# Altium schematic sheet 09_Clocks_2.SchDoc: Clocks 2
size A3; Organization: Lime Microsystems; Address1: Surrey Tech Centre; Address2: Guildford GU2 7YG; Address3: Surrey; Address4: United Kingdom; Revision: v1.0; SheetNumber: 7; SheetTotal: 10
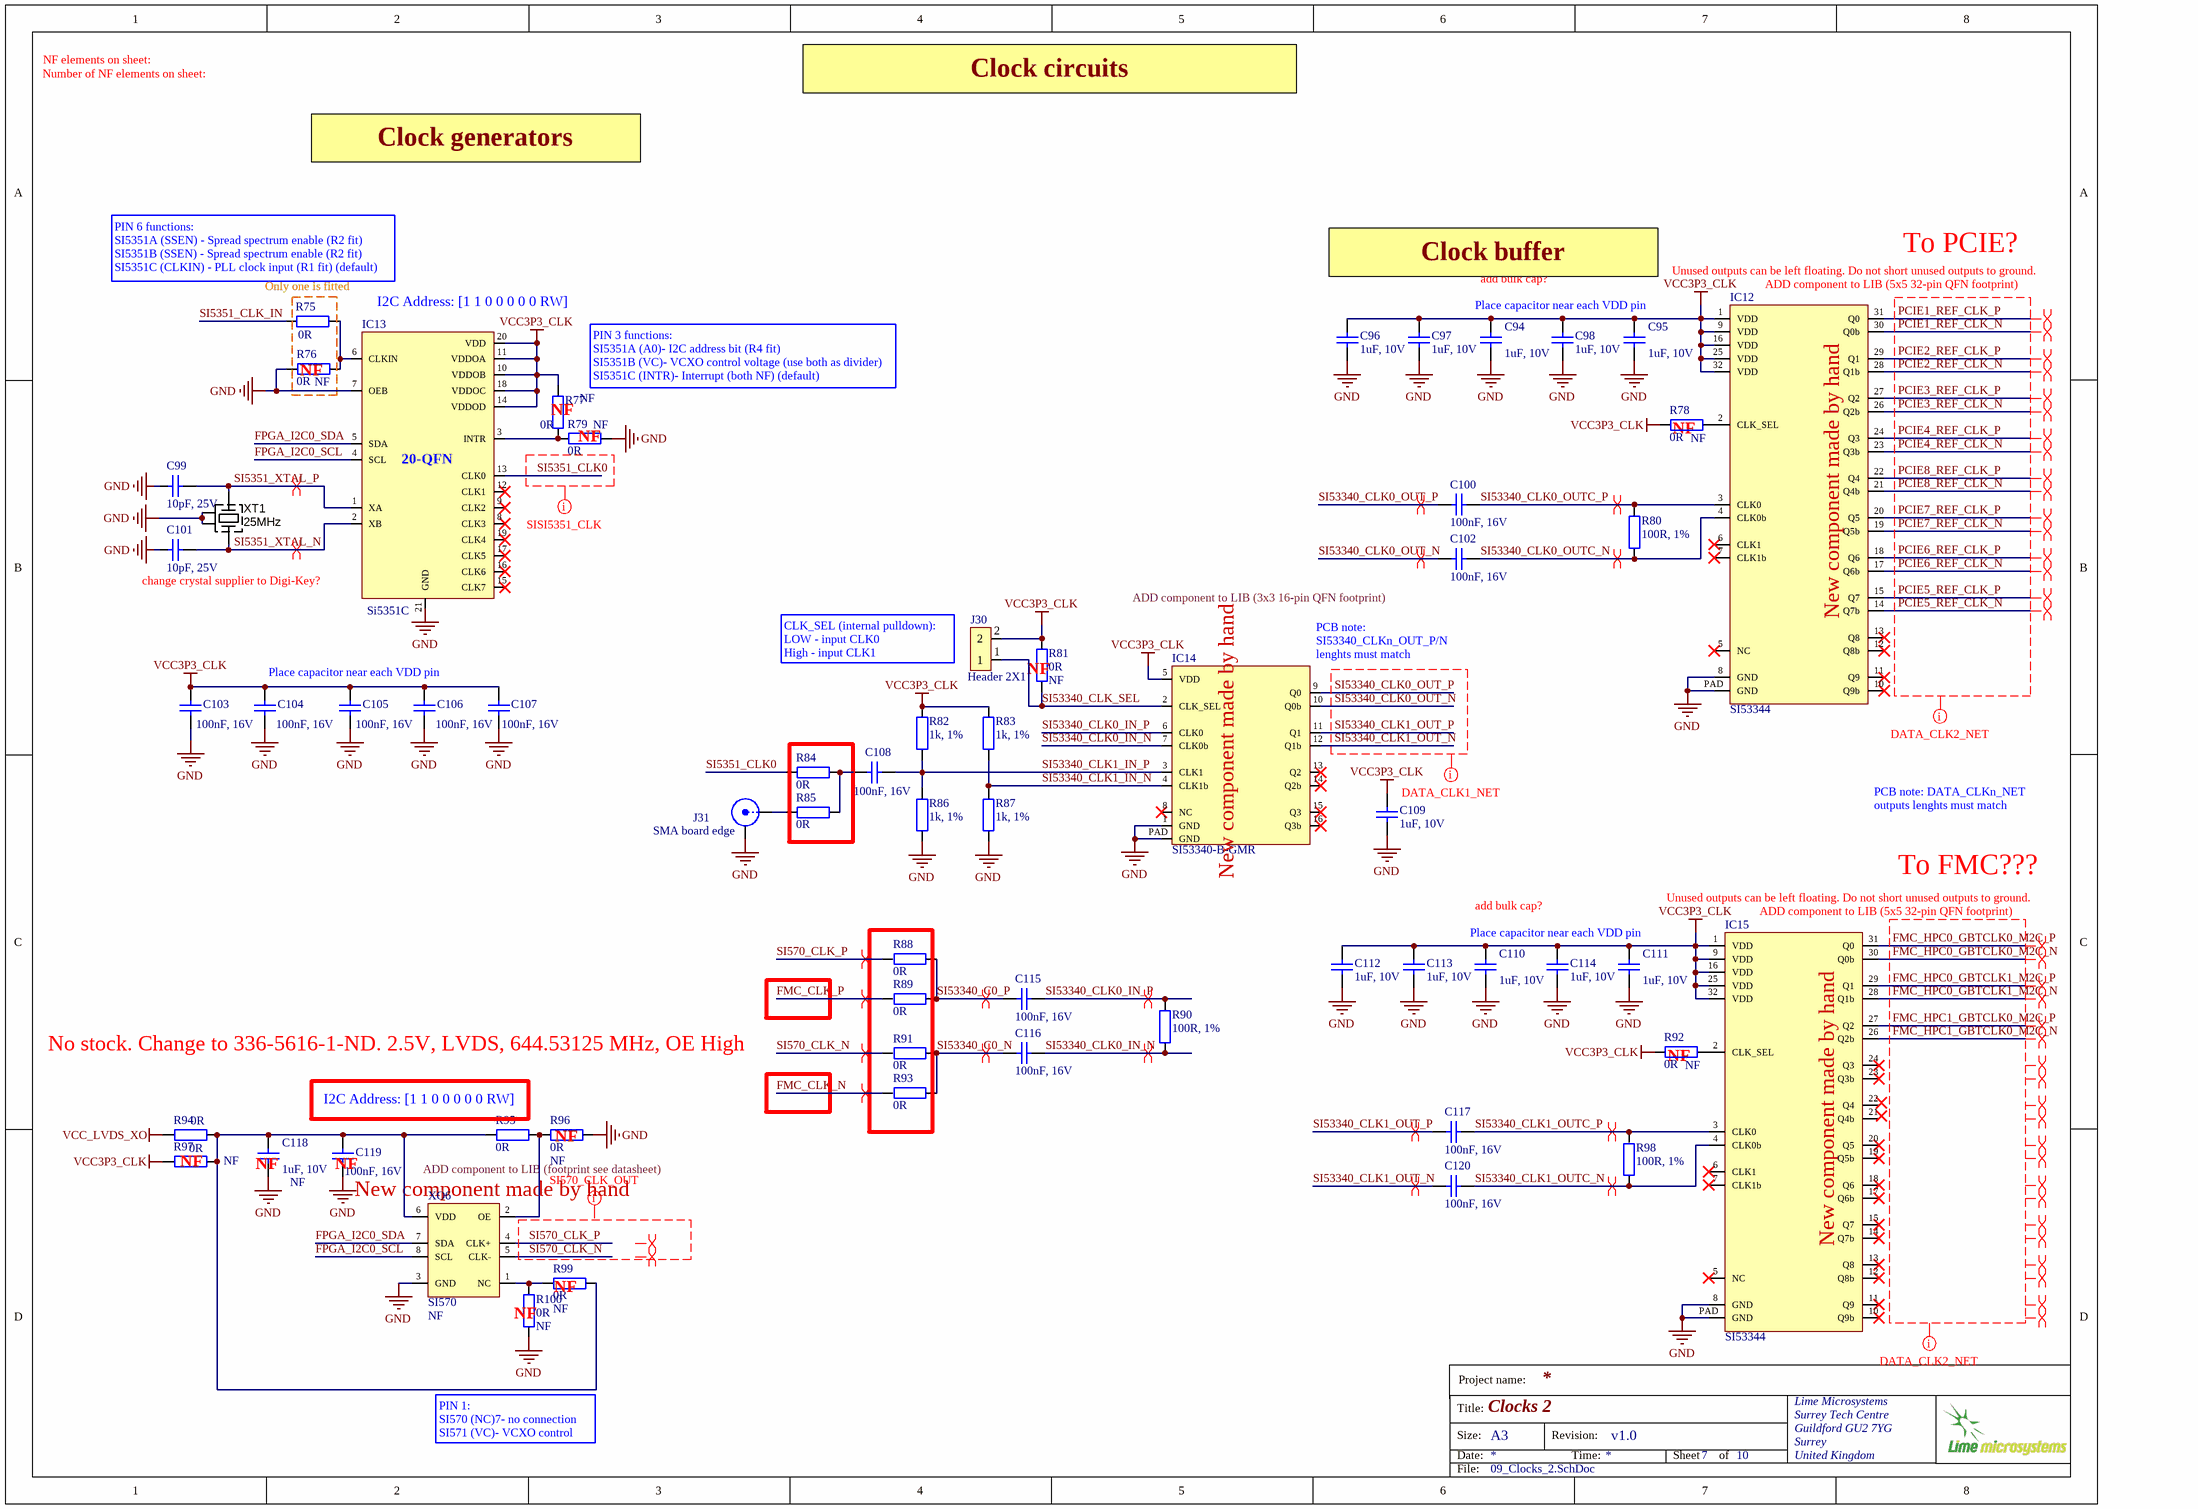
[diagram p0: 09_Clocks_2.SchDoc]

## Parts
C94  1uF, 10V  [CAP0402]
C95  1uF, 10V  [CAP0402]
C96  1uF, 10V  [CAP0402]
C97  1uF, 10V  [CAP0402]
C98  1uF, 10V  [CAP0402]
C99  10pF, 25V  [CAP0402]
C100  100nF, 16V  [CAP0402]
C101  10pF, 25V  [CAP0402]
C102  100nF, 16V  [CAP0402]
C103  100nF, 16V  [CAP0402]
C104  100nF, 16V  [CAP0402]
C105  100nF, 16V  [CAP0402]
C106  100nF, 16V  [CAP0402]
C107  100nF, 16V  [CAP0402]
C108  100nF, 16V  [CAP0402]
C109  1uF, 10V  [CAP0402]
C110  1uF, 10V  [CAP0402]
C111  1uF, 10V  [CAP0402]
C112  1uF, 10V  [CAP0402]
C113  1uF, 10V  [CAP0402]
C114  1uF, 10V  [CAP0402]
C115  100nF, 16V  [CAP0402]
C116  100nF, 16V  [CAP0402]
C117  100nF, 16V  [CAP0402]
C118  1uF, 10V  Assembly Info: NF  [CAP0402]
C119  100nF, 16V  [CAP0402]
C120  100nF, 16V  [CAP0402]
IC12  SI53344  [SI53344-B-GM_32-VFQFN]
IC13  Si5351C  [Si5351C_20QFN]
IC14  SI53340-B-GMR  [SI53340_QFN24]
IC15  SI53344  [SI53344-B-GM_32-VFQFN]
J30  Header 2X1  [HDR_1x2]
J31  SMA board edge  [SMA_connector_board_edge_SM]
R75  0R  [RES0402]
R76  0R  Assembly Info: NF  [RES0402]
R77  0R  Assembly Info: NF  [RES0402]
R78  0R  Assembly Info: NF  [RES0402]
R79  0R  Assembly Info: NF  [RES0402]
R80  100R, 1%  [RES0402]
R81  0R  Assembly Info: NF  [RES0402]
R82  1k, 1%  [RES0402]
R83  1k, 1%  [RES0402]
R84  0R  [RES0402]
R85  0R  [RES0402]
R86  1k, 1%  [RES0402]
R87  1k, 1%  [RES0402]
R88  0R  [RES0402]
R89  0R  [RES0402]
R90  100R, 1%  [RES0402]
R91  0R  [RES0402]
R92  0R  Assembly Info: NF  [RES0402]
R93  0R  [RES0402]
R94  0R  [RES0402]
R95  0R  [RES0402]
R96  0R  Assembly Info: NF  [RES0402]
R97  0R  Assembly Info: NF  [RES0402]
R98  100R, 1%  [RES0402]
R99  0R  Assembly Info: NF  [RES0402]
R100  0R  Assembly Info: NF  [RES0402]
XO6  SI570  Assembly Info: NF  [Si570_Si571_CRYSTAL_8SMD]
XT1  25MHz  [CRYSTAL_4-LCC]

## Nets
GND: C94.1 C95.1 C96.2 C97.2 C98.2 C99.1 C101.1 C103.2 C104.2 C105.2 C106.2 C107.2 C109.2 C110.1 C111.1 C112.2 C113.2 C114.2 C118.1 C119.2 IC12.8(GND) IC12.PAD(GND) IC13.7(OEB) IC13.21(GND) IC14.1(GND) IC14.PAD(GND) IC15.8(GND) IC15.PAD(GND) J31.2(Y) R76.2 R79.2 R86.1 R87.1 R96.1 R100.1 XO6.3(GND) XT1.2(GND) XT1.4(GND)
VCC3P3_CLK: C94.2 C95.2 C96.1 C97.1 C98.1 C103.1 C104.1 C105.1 C106.1 C107.1 C109.1 C110.2 C111.2 C112.1 C113.1 C114.1 IC12.1(VDD) IC12.9(VDD) IC12.16(VDD) IC12.25(VDD) IC12.32(VDD) IC13.10(VDDOB) IC13.11(VDDOA) IC13.14(VDDOD) IC13.18(VDDOC) IC13.20(VDD) IC14.5(VDD) IC15.1(VDD) IC15.9(VDD) IC15.16(VDD) IC15.25(VDD) IC15.32(VDD) J30.2 R77.2 R78.1 R81.1 R82.1 R83.1 R92.1 R97.2
VCC_LVDS_XO: R94.2
FMC_CLK_N: R93.2
FMC_CLK_P: R89.2
FMC_HPC0_GBTCLK0_M2C_N: IC15.30(Q0b)
FMC_HPC0_GBTCLK0_M2C_P: IC15.31(Q0)
FMC_HPC0_GBTCLK1_M2C_N: IC15.28(Q1b)
FMC_HPC0_GBTCLK1_M2C_P: IC15.29(Q1)
FMC_HPC1_GBTCLK0_M2C_N: IC15.26(Q2b)
FMC_HPC1_GBTCLK0_M2C_P: IC15.27(Q2)
FPGA_I2C0_SCL: IC13.4(SCL) XO6.8(SCL)
FPGA_I2C0_SDA: IC13.5(SDA) XO6.7(SDA)
PCIE1_REF_CLK_N: IC12.30(Q0b)
PCIE1_REF_CLK_P: IC12.31(Q0)
PCIE2_REF_CLK_N: IC12.28(Q1b)
PCIE2_REF_CLK_P: IC12.29(Q1)
PCIE3_REF_CLK_N: IC12.26(Q2b)
PCIE3_REF_CLK_P: IC12.27(Q2)
PCIE4_REF_CLK_N: IC12.23(Q3b)
PCIE4_REF_CLK_P: IC12.24(Q3)
PCIE5_REF_CLK_N: IC12.14(Q7b)
PCIE5_REF_CLK_P: IC12.15(Q7)
PCIE6_REF_CLK_N: IC12.17(Q6b)
PCIE6_REF_CLK_P: IC12.18(Q6)
PCIE7_REF_CLK_N: IC12.19(Q5b)
PCIE7_REF_CLK_P: IC12.20(Q5)
PCIE8_REF_CLK_N: IC12.21(Q4b)
PCIE8_REF_CLK_P: IC12.22(Q4)
SI570_CLK_N: R91.2 XO6.5(CLK-)
SI570_CLK_P: R88.2 XO6.4(CLK+)
SI5351_CLK0: IC13.13(CLK0) R84.2
SI5351_CLK_IN: R75.1
SI5351_XTAL_N: C101.2 IC13.2(XB) XT1.3(X)
SI5351_XTAL_P: C99.2 IC13.1(XA) XT1.1(X)
SI53340_C0_N: C116.1 R91.1 R93.1
SI53340_C0_P: C115.1 R88.1 R89.1
SI53340_CLK0_IN_N: C116.2 IC14.7(CLK0b) R90.1
SI53340_CLK0_IN_P: C115.2 IC14.6(CLK0) R90.2
SI53340_CLK0_OUT_N: C102.1 IC14.10(Q0b)
SI53340_CLK0_OUT_P: C100.1 IC14.9(Q0)
SI53340_CLK0_OUTC_N: C102.2 IC12.4(CLK0b) R80.1
SI53340_CLK0_OUTC_P: C100.2 IC12.3(CLK0) R80.2
SI53340_CLK1_IN_N: IC14.4(CLK1b) R83.2 R87.2
SI53340_CLK1_IN_P: C108.2 IC14.3(CLK1) R82.2 R86.2
SI53340_CLK1_OUT_N: C120.1 IC14.12(Q1b)
SI53340_CLK1_OUT_P: C117.1 IC14.11(Q1)
SI53340_CLK1_OUTC_N: C120.2 IC15.4(CLK0b) R98.1
SI53340_CLK1_OUTC_P: C117.2 IC15.3(CLK0) R98.2
SI53340_CLK_SEL: IC14.2(CLK_SEL) J30.1 R81.2
NetC108_1: C108.1 R84.1 R85.1
NetC118_2: C118.2 C119.1 R94.1 R95.2 R97.1 R99.1 XO6.6(VDD)
NetIC12_2: IC12.2(CLK_SEL) R78.2
NetIC13_3: IC13.3(INTR) R77.1 R79.1
NetIC13_6: IC13.6(CLKIN) R75.2 R76.1
NetIC15_2: IC15.2(CLK_SEL) R92.2
NetJ31_1: J31.1(X) R85.2
NetR95_1: R95.1 R96.2 XO6.2(OE)
NetR99_2: R99.2 R100.2 XO6.1(NC)

Not connected (* = marked no-connect by the designer): IC12 5(NC)* 6(CLK1)* 7(CLK1b)* 10(Q9b)* 11(Q9)* 12(Q8b)* 13(Q8)*; IC13 8(CLK3)* 9(CLK2)* 12(CLK1)* 15(CLK7)* 16(CLK6)* 17(CLK5)* 19(CLK4)*; IC14 8(NC)* 13(Q2)* 14(Q2b)* 15(Q3)* 16(Q3b)*; IC15 5(NC)* 6(CLK1)* 7(CLK1b)* 10(Q9b)* 11(Q9)* 12(Q8b)* 13(Q8)* 14(Q7b)* 15(Q7)* 17(Q6b)* 18(Q6)* 19(Q5b)* 20(Q5)* 21(Q4b) 22(Q4) 23(Q3b)* 24(Q3)*

## Layout directives
differential pair: FMC_CLK_N, FMC_CLK_P, FMC_HPC0_GBTCLK0_M2C_N, FMC_HPC0_GBTCLK0_M2C_P, FMC_HPC0_GBTCLK1_M2C_N, FMC_HPC0_GBTCLK1_M2C_P, FMC_HPC1_GBTCLK0_M2C_N, FMC_HPC1_GBTCLK0_M2C_P, PCIE1_REF_CLK_N, PCIE1_REF_CLK_P, PCIE2_REF_CLK_N, PCIE2_REF_CLK_P, PCIE3_REF_CLK_N, PCIE3_REF_CLK_P, PCIE4_REF_CLK_N, PCIE4_REF_CLK_P, PCIE5_REF_CLK_N, PCIE5_REF_CLK_P, PCIE6_REF_CLK_N, PCIE6_REF_CLK_P, PCIE7_REF_CLK_N, PCIE7_REF_CLK_P, PCIE8_REF_CLK_N, PCIE8_REF_CLK_P, SI570_CLK_N, SI570_CLK_P, SI5351_XTAL_N, SI5351_XTAL_P, SI53340_C0_N, SI53340_C0_P, SI53340_CLK0_IN_N, SI53340_CLK0_IN_P, SI53340_CLK0_OUT_N, SI53340_CLK0_OUT_P, SI53340_CLK0_OUTC_N, SI53340_CLK0_OUTC_P, SI53340_CLK1_OUT_N, SI53340_CLK1_OUT_P, SI53340_CLK1_OUTC_N, SI53340_CLK1_OUTC_P
net class SI_CLK: (no net found under the mark), SI5351_CLK0
net class DATA_CLK1_NET: SI53340_CLK0_OUT_N, SI53340_CLK0_OUT_P, SI53340_CLK1_OUT_N, SI53340_CLK1_OUT_P
net class DATA_CLK2_NET: FMC_HPC0_GBTCLK0_M2C_N, FMC_HPC0_GBTCLK0_M2C_P, FMC_HPC0_GBTCLK1_M2C_N, FMC_HPC0_GBTCLK1_M2C_P, FMC_HPC1_GBTCLK0_M2C_N, FMC_HPC1_GBTCLK0_M2C_P, PCIE1_REF_CLK_N, PCIE1_REF_CLK_P, PCIE2_REF_CLK_N, PCIE2_REF_CLK_P, PCIE3_REF_CLK_N, PCIE3_REF_CLK_P, PCIE4_REF_CLK_N, PCIE4_REF_CLK_P, PCIE5_REF_CLK_N, PCIE5_REF_CLK_P, PCIE6_REF_CLK_N, PCIE6_REF_CLK_P, PCIE7_REF_CLK_N, PCIE7_REF_CLK_P, PCIE8_REF_CLK_N, PCIE8_REF_CLK_P

## Notes on the sheet
- Number of NF elements on sheet:
- NF elements on sheet:
- Clock circuits
- Clock generators
- PIN 6 functions:
  SI5351A (SSEN) - Spread spectrum enable (R2 fit)
  SI5351B (SSEN) - Spread spectrum enable (R2 fit)
  SI5351C (CLKIN) - PLL clock input (R1 fit) (default)
- (near R75) Only one is fitted
- I2C Address: [1 1 0 0 0 0 0 RW]
- Clock buffer
- Place capacitor near each VDD pin
- add bulk cap?
- (near IC12) Unused outputs can be left floating. Do not short unused outputs to ground.
- (near IC12) ADD component to LIB (5x5 32-pin QFN footprint)
- To PCIE?
- (near R76) NF
- PIN 3 functions:
  SI5351A (A0)- I2C address bit (R4 fit)
  SI5351B (VC)- VCXO control voltage (use both as divider)
  SI5351C (INTR)- Interrupt (both NF) (default)
- (near R77) NF
- (near R79) NF
- (near R78) NF
- (near IC13) change crystal supplier to Digi-Key?
- ADD component to LIB (3x3 16-pin QFN footprint)
- (near IC12) New component made by hand
- CLK_SEL (internal pulldown):
  LOW - input CLK0
  High - input CLK1
- (near R81) NF
- (near IC14) PCB note: SI53340_CLKn_OUT_P/N lenghts must match
- PCB note: DATA_CLKn_NET outputs lenghts must match
- (near IC14) New component made by hand
- (near IC15) Unused outputs can be left floating. Do not short unused outputs to ground.
- (near IC15) ADD component to LIB (5x5 32-pin QFN footprint)
- To FMC???
- No stock. Change to 336-5616-1-ND. 2.5V, LVDS, 644.53125 MHz, OE High
- (near R92) NF
- (near R97) NF
- (near C118) NF
- (near C119) NF
- ADD component to LIB (footprint see datasheet)
- (near R96) NF
- New component made by hand
- (near IC15) New component made by hand
- (near R100) NF
- (near R99) NF
- PIN 1:
  SI570 (NC)7- no connection
  SI571 (VC)- VCXO control
- Project name:
- Title:
- Size:
- Date:
- A3
- Revision:
- Time:
- Sheet
- of
- File:
- (in symbol Si5351C) 20-QFN

## Library data of the parts
C94-C98 C109-C114 C118 = Cap_0402: CAP CER 1UF 10V X5R 0402; Manufacturer: Yageo; Part Description: 1µF 10V Ceramic Capacitor X5R 0402 (1005 Metric) 0.039" L x 0.020" W (1.00mm x 0.50mm); Manufacturer Part Number 1: CC0402MRX5R6BB105; Notification: Current market demand for these product types have resulted in fluctuating and extending lead times. Lead times may differ.; Tolerance: ±20%; Value: 1uF, 10V; Supplier 1: Digi-Key; Supplier Part Number 1: 311-1732-1-ND; RoHS: RoHS Compliant; Applications: General Purpose; Category: Capacitors; ComponentLink1Description: http://www.yageo.com/documents/recent/UPY-GPHC_X5R_4V-to-50V_25.pdf; ComponentLink1URL: http://www.yageo.com/documents/recent/UPY-GPHC_X5R_4V-to-50V_25.pdf; Failure Rate: -; Features: -; Height - Seated (Max): -; Lead Spacing: -; Lead Style: -; Mounting Type: Surface Mount, MLCC; Operating Temperature: -55°C ~ 85°C; Package / Case: 0402 (1005 Metric); Packaging: Cut Tape (CT); Part Status: Active; Pricing 1: 1=0.22, 10=0.156, 100=0.0732, 500=0.0513, 1000=0.04248, 2500=0.03953, 5000=0.03617 (USD); Ratings: -; Size / Dimension: 0.039" L x 0.020" W (1.00mm x 0.50mm); Stock 1: 69600; Temperature Coefficient: X5R; Thickness (Max): 0.022" (0.55mm); Voltage - Rated: 10V
C99 C101 = Cap_0402: Manufacturer: AVX; Part Description: 10pF ±5% 25V C0G, NP0 Ceramic Capacitor -55°C ~ 125°C Surface Mount, MLCC 0402 (1005 Metric) 0.039" L x 0.020" W (1.00mm x 0.50mm); Capacitance: 10; Ceramic Capacitor Case: 0402 [1005 Metric]; Capacitance Tolerance: ± 5%; Supplier 1: Farnell; Supplier Part Number 1: 2332478RL; value: 10pF, 25V
C100 C102-C108 C115-C117 C120 = Cap_0603: Manufacturer Part Number 1: GRM155R71C104KA88D; Part Description: 0.10µF ±10% 16V X7R Ceramic Capacitor -55°C ~ 125°C Surface Mount, MLCC 0402 (1005 Metric) 0.039" L x 0.020" W (1.00mm x 0.50mm); Brand: Murata Electronics; Tolerance: 10 %; Type: General Purpose MLCC; Capacitance: 0.1 uF; Temperature Coefficient / Code: +/- 15 %; Supplier 1: Mouser; Supplier Part Number 1: 81-GRM155R71C104KA88; Case Code - in: 0402; Manufacturer: Murata Electronics; Category: Multilayer Ceramic Capacitors MLCC - SMD/SMT; Voltage Rating DC: 16 V; Value: 100nF, 16V; Manufacturer Part Number: GRM155R71C104KA88D
C119 = Cap_0603: Manufacturer Part Number 1: GRM155R71C104KA88D; Part Description: 0.10µF ±10% 16V X7R Ceramic Capacitor -55°C ~ 125°C Surface Mount, MLCC 0402 (1005 Metric) 0.039" L x 0.020" W (1.00mm x 0.50mm); Brand: Murata Electronics; Tolerance: 10 %; Type: General Purpose MLCC; Capacitance: 0.1 uF; Temperature Coefficient / Code: +/- 15 %; Assembly Info: NF; Supplier 1: Mouser; Supplier Part Number 1: 81-GRM155R71C104KA88; Case Code - in: 0402; Manufacturer: Murata Electronics; Category: Multilayer Ceramic Capacitors MLCC - SMD/SMT; Voltage Rating DC: 16 V; Value: 100nF, 16V; Manufacturer Part Number: GRM155R71C104KA88D
IC12 IC15 = SI53344: Manufacturer: Skyworks Solutions; Manufacturer Part Number 1: SI53344-B-GM; Part Description: Clock Fanout Buffer (Distribution), Multiplexer IC 2:10 1.25 GHz 32-VFQFN Exposed Pad; Supplier 1: Digi-Key; Supplier Part Number 1: 336-3842-ND; Stock 1: 4927; Pricing 1: 1=4,47000, 10=4,01100, 25=3,79200, 80=3,28650, 230=3,11800, 490=2,79776, 980=2,38500 (USD); RoHS: No
IC13 = Si5351C: Manufacturer Part Number 1: SI5351C-B-GM; Part Description: IC CLK GENERATOR 200MHZ 20QFN; Manufacturer: Silicon Labs; Voltage - Supply: 1.71 V ~ 3.6 V; Input: Clock, Crystal; Ratio - Input:Output: 2:8; Frequency - Max: 160MHz; Supplier 1: Digi-Key; Supplier Device Package: 20-QFN (4x4); Type: Clock Generator; Package / Case: 20-VFQFN Exposed Pad; Category: Integrated Circuits (ICs); Supplier Part Number 1: 336-2402-ND
IC14 = SI53340-B-GMR: Clock Fanout Buffer (Distribution), Multiplexer IC 2:4 1.25 GHz 16-VFQFN Exposed Pad; Manufacturer: Skyworks Solutions; Part Description: 2: 4 LVDS buffer (1.25GHz), 2: 1 input mux, (QFN16), footprint compatible: CDCLVP1204; Supplier 1: Digi-Key; Manufacturer Part Number 1: SI53340-B-GMR; Stock 1: 17153; Pricing 1: 1=3,29, 10=2,952, 25=2,7904, 100=2,4184, 250=2,29436, 500=2,05874 (USD); RoHS: No; Supplier Part Number 1: 336-4763-1-ND
J30 = Jumper: Manufacturer Part Number 1: 961102-6404-AR; Part Description: 2 Positions Header, Unshrouded Connector 0.100" (2.54mm) Through Hole Gold; Manufacturer: 3M; Connector Type: Header, Unshrouded; Supplier 1: Digi-Key; Supplier Part Number 1: 3M9447-ND; Contact Type: Male Pin; Color: Black; Mounting Type: Through Hole; Category: Connectors, Interconnects; Contact Finish: Gold
J31 = RF_IF_connector: CONN SMA JACK STR 50OHM EDGE MNT; Manufacturer: RF Solutions; Manufacturer Part Number 1: CON-SMA-EDGE-S; Part Description: SMA Connector Jack, Female Socket Board Edge, End Launch Solder; Connector Type: Jack, Female Socket; Contact Termination: Solder; Supplier 1: Digi-Key; Supplier Part Number 1: CON-SMA-EDGE-S-ND; RoHS: RoHS Compliant; Category: Connectors, Interconnects; Stock 1: 1751; Pricing 1: 1=2.1 (USD); Packaging: -; Part Status: Active; Connector Style: SMA; Shield Termination: Solder; Impedance: -; Mounting Type: Board Edge, End Launch; Mounting Feature: -; Cable Group: -; Fastening Type: Threaded; Frequency - Max: -; Features: -; Housing Color: -; Ingress Protection: -; Includes: -; Body Material: -; Body Finish: -; Center Contact Plating: -; Dielectric Material: -; Operating Temperature: -; Center Contact Material: -; Voltage Rating: -; Mating Cycles: -; Insertion Loss: -; ComponentLink1URL: http://media.digikey.com/pdf/Data%20Sheets/RF%20Solutions%20PDFs/CON-SMA-EDGE.pdf; ComponentLink1Description: http://media.digikey.com/pdf/Data%20Sheets/RF%20Solutions%20PDFs/CON-SMA-EDGE.pdf
R75-R79 R81 R84 R85 R88 R89 R91-R97 R99 R100 = Res_0402: Manufacturer Part Number 1: RC0402JR-070RL; Manufacturer: Yageo; Part Description: RES SMD 0.0OHM JUMPER 1/16W 0402; Resistance (Ohms): 0.0; Tolerance: Jumper; Power (Watts): 0.063W, 1/16W; Value: 0R; Supplier 1: Digi-Key; Supplier Part Number 1: 311-0.0JRTR-ND; Category: Resistors; Temperature Coefficient: -; Features: Moisture Resistant; Supplier Device Package: 0402; Height: 0.016" (0.40mm); Package / Case: 0402 (1005 Metric); Operating Temperature: -55°C ~ 155°C; Size / Dimension: 0.039" L x 0.020" W (1.00mm x 0.50mm); Composition: Thick Film; Packaging: Tape & Reel (TR); Number of Terminations: 2; RoHS: RoHS Compliant
R80 R90 R98 = Res_0402: Manufacturer Part Number 1: RMCF0402FT100R; Part Description: RES SMD 100 OHM 1% 1/16W 0402; Manufacturer: Stackpole Electronics Inc.; Temperature Coefficient: ±100ppm/°C; Supplier 1: Digi-Key; Supplier Part Number 1: RMCF0402FT100RDKR-ND; Package / Case: 0402 (1005 Metric); Composition: Thick Film; Category: Resistors; Tolerance: ±1%; Value: 100R, 1%
R82 R83 R86 R87 = Res_0402: Manufacturer: Stackpole Electronics Inc; Manufacturer Part Number 1: RMCF0402FT1K00; Part Description: RES SMD 1K OHM 1% 1/16W 0402; Temperature Coefficient: ±100ppm/°C; Power (Watts): 0.063W, 1/16W; Value: 1k, 1%; Supplier 1: Digi-Key; Supplier Part Number 1: RMCF0402FT1K00TR-ND; Resistance (Ohms): 1k; Packaging: Tape & Reel (TR); Category: Resistors; RoHS: RoHS Compliant; Tolerance: ±1%; Height: 0.016" (0.40mm); Number of Terminations: 2; Package / Case: 0402 (1005 Metric); Operating Temperature: -55°C ~ 155°C; Features: -; Composition: Thick Film; Supplier Device Package: 0402; Size / Dimension: 0.039" L x 0.020" W (1.00mm x 0.50mm)
XO6 = SI570: Part Description: XTAL OSC XO 300.0000MHZ LVDS SMD; Manufacturer: Silicon Labs; Manufacturer Part Number 1: 570BAB001614DGR; ComponentLink1URL: https://datasheet.ciiva.com/9287/si570-9287030.pdf?src-supplier=Avnet; ComponentLink1Description: https://datasheet.ciiva.com/9287/si570-9287030.pdf?src-supplier=Avnet; Supplier 1: Digi-Key; Supplier Part Number 1: 336-5615-1-ND; Stock 1: 82; Pricing 1: 250=23,87000 (EUR); RoHS: Yes
XT1 = CRYSTAL_19M2: Oscillator Crystal 25 MHz; Manufacturer Part Number 1: ABM8-25.000MHZ-B2-T; Manufacturer: ABRACON; Part Description: 25MHz ±20ppm Crystal 18pF 50 Ohm -20°C ~ 70°C Surface Mount 4-SMD, No Lead (DFN, LCC); Supplier 1: Newark; Supplier Part Number 1: 13J1767